# Altium project LSS_Sub_Board_v1.1.PrjPcb
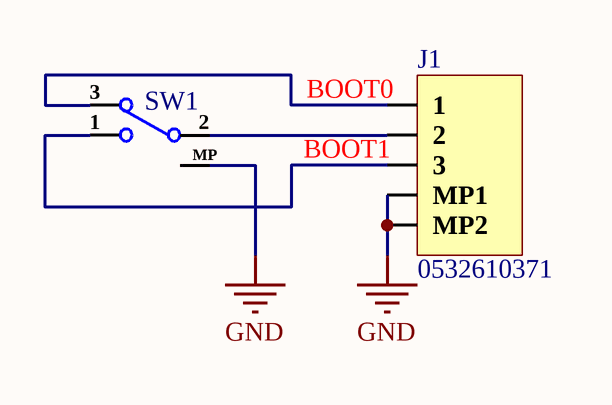
[diagram p0: Connector-Section.SchDoc]
1 sheet, 2 parts. Net scope: global (net labels, ports and power ports of the same name join across sheets).
Board file: LSS-P-PCB-S v1.1.PcbDoc

## Sheet Connector-Section.SchDoc
size A; SheetNumber: 1; SheetTotal: 1

### Parts
J1  0532610371  [0532610371]
SW1  PCM12SMTR  [PCM12SMTR_]  (value not drawn)

### Nets
GND: J1.MP1 J1.MP2 SW1.MP
NetJ1_1: J1.1 SW1.3
NetJ1_2: J1.2 SW1.2
NetJ1_3: J1.3 SW1.1

### Notes on the sheet
- (near J1) BOOT0
- (near J1) BOOT1

### Library data of the parts
J1 = 0532610371: CONN HEADER SMD R/A 3POS 1.25MM; Manufacturer: Molex; Manufacturer Part Number: 53261-0371; Item Type: Right Angle JST; Supplier: Mouser; Supplier Part Number: 538-53261-0371; RoHS: Yes; Category: Headers and Wire Housings; Stock: 46452; Pricing: 1=0.69, 10=0.582, 50=0.582, 100=0.452, 1000=0.359, 10000=0.275 (USD)
SW1 = PCM12SMTR: SWITCH SLIDE SPDT 300MA 6V; Manufacturer: ITT C&K; Mechanical Life: 10000Cycles; Actuator Material: Nylon,Polyamide; Contact Resistance: 70mR; Insulation Resistance: 100mR; Switch Travel: 1.5mm; Switch Function: On-On; Actuator Type: Standard; Item Type: Slide Switch; Supplier 1: Digi-Key; Manufacturer Part Number: PCM12SMTR; Stock 1: 33578; Pricing 1: 1=0.91, 10=0.87, 25=0.8524, 50=0.7616, 100=0.7253, 250=0.7072, 500=0.5984, 1000=0.58027 (USD); Mount: Surface Mount; Contact Material: Copper Alloy,Copper,Silver; Contact Plating: Silver; Min Operating Temperature: -20°C; Max Operating Temperature: 85°C; Throw Configuration: SPDT; Max Voltage Rating (DC): 6V; Termination: Gull Wing; Voltage Rating (AC): 6V; Package Quantity: 1; Packaging: Tape and Reel; Voltage Rating (DC): 6V; Max Current Rating: 300mA; Contact Current Rating: 300mA; Current Rating: 300mA; Orientation: Right Angle; Length: 7.7mm; Width: 6.7mm; Depth: 5mm; Actuator Length: 1.5mm; REACH SVHC: No SVHC; Lead Free: Lead Free; ComponentLink1URL: https://www.ckswitches.com/media/1424/pcm.pdf?src-supplier=Digi-Key; ComponentLink1Description: https://www.ckswitches.com/media/1424/pcm.pdf?src-supplier=Digi-Key; ComponentLink2URL: https://products.avnet.com/shop/en/asia/switches-and-relays/switches/slide-switch/www.ckswitches.com/media/1424/pcm.pdf?src-supplier=Avnet+Asia; ComponentLink2Description: https://products.avnet.com/shop/en/asia/switches-and-relays/switches/slide-switch/www.ckswitches.com/media/1424/pcm.pdf?src-supplier=Avnet+Asia; ComponentLink3URL: http://www1.futureelectronics.com/doc/C%20&%20K%20COMPONENTS/PCM12SMTR.pdf?src-supplier=Future+Electronics; ComponentLink3Description: http://www1.futureelectronics.com/doc/C%20&%20K%20COMPONENTS/PCM12SMTR.pdf?src-supplier=Future+Electronics; ComponentLink4URL: http://www.farnell.com/datasheets/1789487.pdf?src-supplier=Onlinecomponents.com; ComponentLink4Description: http://www.farnell.com/datasheets/1789487.pdf?src-supplier=Onlinecomponents.com; ComponentLink5URL: http://www.farnell.com/datasheets/1789487.pdf?src-supplier=Element14; ComponentLink5Description: http://www.farnell.com/datasheets/1789487.pdf?src-supplier=Element14; ComponentLink6URL: http://www.farnell.com/datasheets/1789487.pdf?src-supplier=Mouser; ComponentLink6Description: http://www.farnell.com/datasheets/1789487.pdf?src-supplier=Mouser; Supplier Part Number 1: 401-2016-1-ND